# Altium schematic sheet Speaker et enregistreur.SchDoc
size Letter; Organization: Cegep Limoilou; Address1: 1300, 8e Avenue; Address2: Québec, QC; Address3: Canada; Address4: G1J 5L5; Revision: Enseignants; SheetNumber: 3; SheetTotal: 9; Conception: Ilyes Gharmoul; Titre: Speaker enregistreur; Modification: Ilyes G
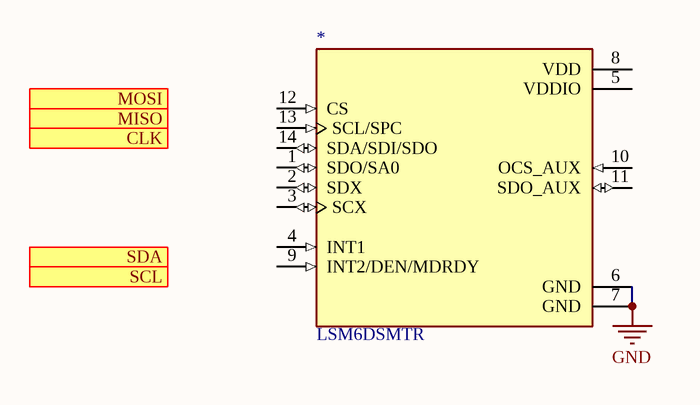
[diagram p0: Speaker et enregistreur.SchDoc]

## Parts
*  LSM6DSMTR  [PQFN50P300X250X86-14N]

## Ports
CLK, MISO, MOSI, SCL, SDA

## Nets
GND: *.6(GND) *.7(GND)

Not connected (* = marked no-connect by the designer): * 1(SDO/SA0) 2(SDX) 3(SCX) 4(INT1) 5(VDDIO) 8(VDD) 9(INT2/DEN/MDRDY) 10(OCS_AUX) 11(SDO_AUX) 12(CS) 13(SCL/SPC) 14(SDA/SDI/SDO)

## Notes on the sheet
- Titre :
- Conception :
- Date :
- Modification :
- Heure :
- Révision :
- Feuille
- de
- Fichier :